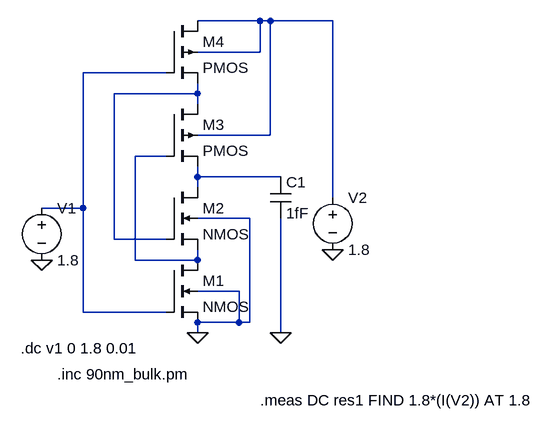
[diagram p0: schematic staticpowerLECTOR@1.8.asc]
staticpowerLECTOR@1.8.asc, the LTspice schematic file:
Version 4
SHEET 1 880 680
WIRE 352 -96 256 -96
WIRE 368 -96 352 -96
WIRE 464 -96 368 -96
WIRE 352 -48 352 -96
WIRE 352 -48 256 -48
WIRE 208 -16 80 -16
WIRE 256 16 256 0
WIRE 256 16 128 16
WIRE 256 32 256 16
WIRE 368 80 368 -96
WIRE 368 80 256 80
WIRE 208 112 160 112
WIRE 256 144 256 128
WIRE 384 144 256 144
WIRE 256 160 256 144
WIRE 464 176 464 -96
WIRE 80 192 80 -16
WIRE 80 192 16 192
WIRE 336 208 256 208
WIRE 128 240 128 16
WIRE 208 240 128 240
WIRE 160 272 160 112
WIRE 256 272 256 256
WIRE 256 272 160 272
WIRE 320 320 256 320
WIRE 80 352 80 192
WIRE 208 352 80 352
WIRE 320 368 320 320
WIRE 320 368 256 368
WIRE 336 368 336 208
WIRE 336 368 320 368
WIRE 256 384 256 368
WIRE 384 384 384 208
FLAG 16 272 0
FLAG 256 384 0
FLAG 464 256 0
FLAG 384 384 0
SYMBOL voltage 16 176 R0
SYMATTR InstName V1
SYMATTR Value 1.8
SYMBOL voltage 464 160 R0
SYMATTR InstName V2
SYMATTR Value 1.8
SYMBOL nmos4 208 272 R0
SYMATTR InstName M1
SYMATTR Value2 l=100n w=4000n
SYMBOL nmos4 208 160 R0
SYMATTR InstName M2
SYMATTR Value2 l=100n w=4000n
SYMBOL pmos4 208 32 R0
SYMATTR InstName M3
SYMATTR Value2 l=100n w=12000n
SYMBOL pmos4 208 -96 R0
SYMATTR InstName M4
SYMATTR Value2 l=100n w=12000n
SYMBOL cap 368 144 R0
SYMATTR InstName C1
SYMATTR Value 1fF
TEXT -16 408 Left 2 !.dc v1 0 1.8 0.01
TEXT 40 448 Left 2 !.inc 90nm_bulk.pm
TEXT 352 488 Left 2 !.meas DC res1 FIND 1.8*(I(V2)) AT 1.8

The netlist it stands for:
* staticpowerLECTOR@1.8.asc
V1 N002 0 1.8
V2 N001 0 1.8
M1 N004 N002 0 0 NMOS l=100n w=4000n
M2 N005 N003 N004 0 NMOS l=100n w=4000n
M3 N003 N004 N005 N001 PMOS l=100n w=12000n
M4 N001 N002 N003 N001 PMOS l=100n w=12000n
C1 N005 0 1fF
.model NMOS NMOS
.model PMOS PMOS
.lib standard.mos
.dc v1 0 1.8 0.01
.inc 90nm_bulk.pm
.meas DC res1 FIND 1.8*(I(V2)) AT 1.8
.backanno
.end